# Altium project SENSOR_BOARD.PrjPcb
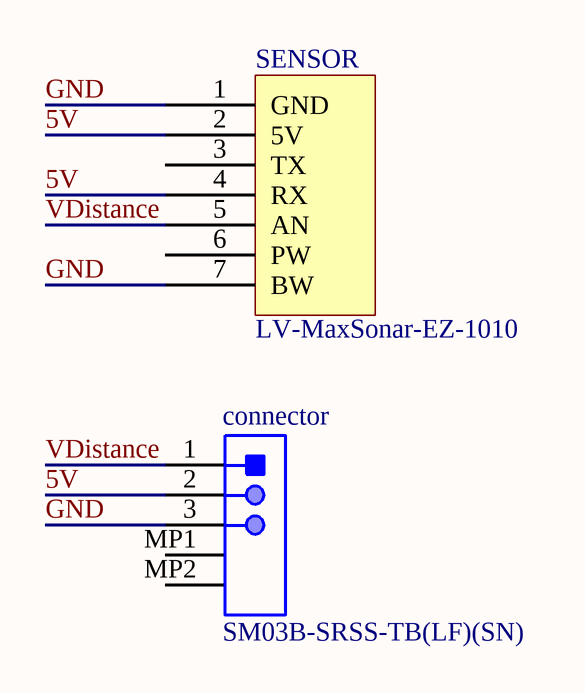
[diagram p0: SENSOR.SchDoc]
1 sheet, 2 parts. Net scope: global (net labels, ports and power ports of the same name join across sheets).
Board file: SENSORS.PcbDoc

## Sheet SENSOR.SchDoc
size A; SheetNumber: 4; SheetTotal: 4

### Parts
connector  SM03B-SRSS-TB(LF)(SN)  [JST-SM03B-SRSS-TB_V]
SENSOR  LV-MaxSonar-EZ-1010  [LV-MaxSonar-EZ-1010-Footprint-1]

### Nets
5V: connector.2 SENSOR.2(5V) SENSOR.4(RX)
GND: connector.3 SENSOR.1(GND) SENSOR.7(BW)
VDistance: connector.1 SENSOR.5(AN)

Not connected (* = marked no-connect by the designer): connector MP1 MP2; SENSOR 3(TX) 6(PW)

### Library data of the parts
connector = CMP-2000-07077-1: Male Header, Pitch 1 mm, 1 x 3 Position, Height 2.9 mm, -25 to 85 degC, RoHS, Tape and Reel; Manufacturer: JST; Pitch: 1mm; Style/Orientation: RightAngleHeader/Plug; No of Positions: 3; Package Description: Male Header, Pitch 1 mm, 1 x 3 Position, Height 2.9 mm; Manufacturer URL: http://www.jst.com/home2.html; Package Reference: SM03B-SRSS-TB; Type: ShroudedHeader; Termination: Crimp; Mounting Technology: SurfaceMount; Datasheet Version: 11/2010; Datasheet URL: https://datasheet.ciiva.com/26894/getdatasheetpartid-708885-26894671.pdf
SENSOR = CMP-00003-2: Ultrasonic sensor